# Altium schematic sheet TIA_SWITCHES.SchDoc
size A3; DrawnBy: Nicholas Sandor; Revision: V26C (V26.4a); SheetNumber: 5; SheetTotal: 7
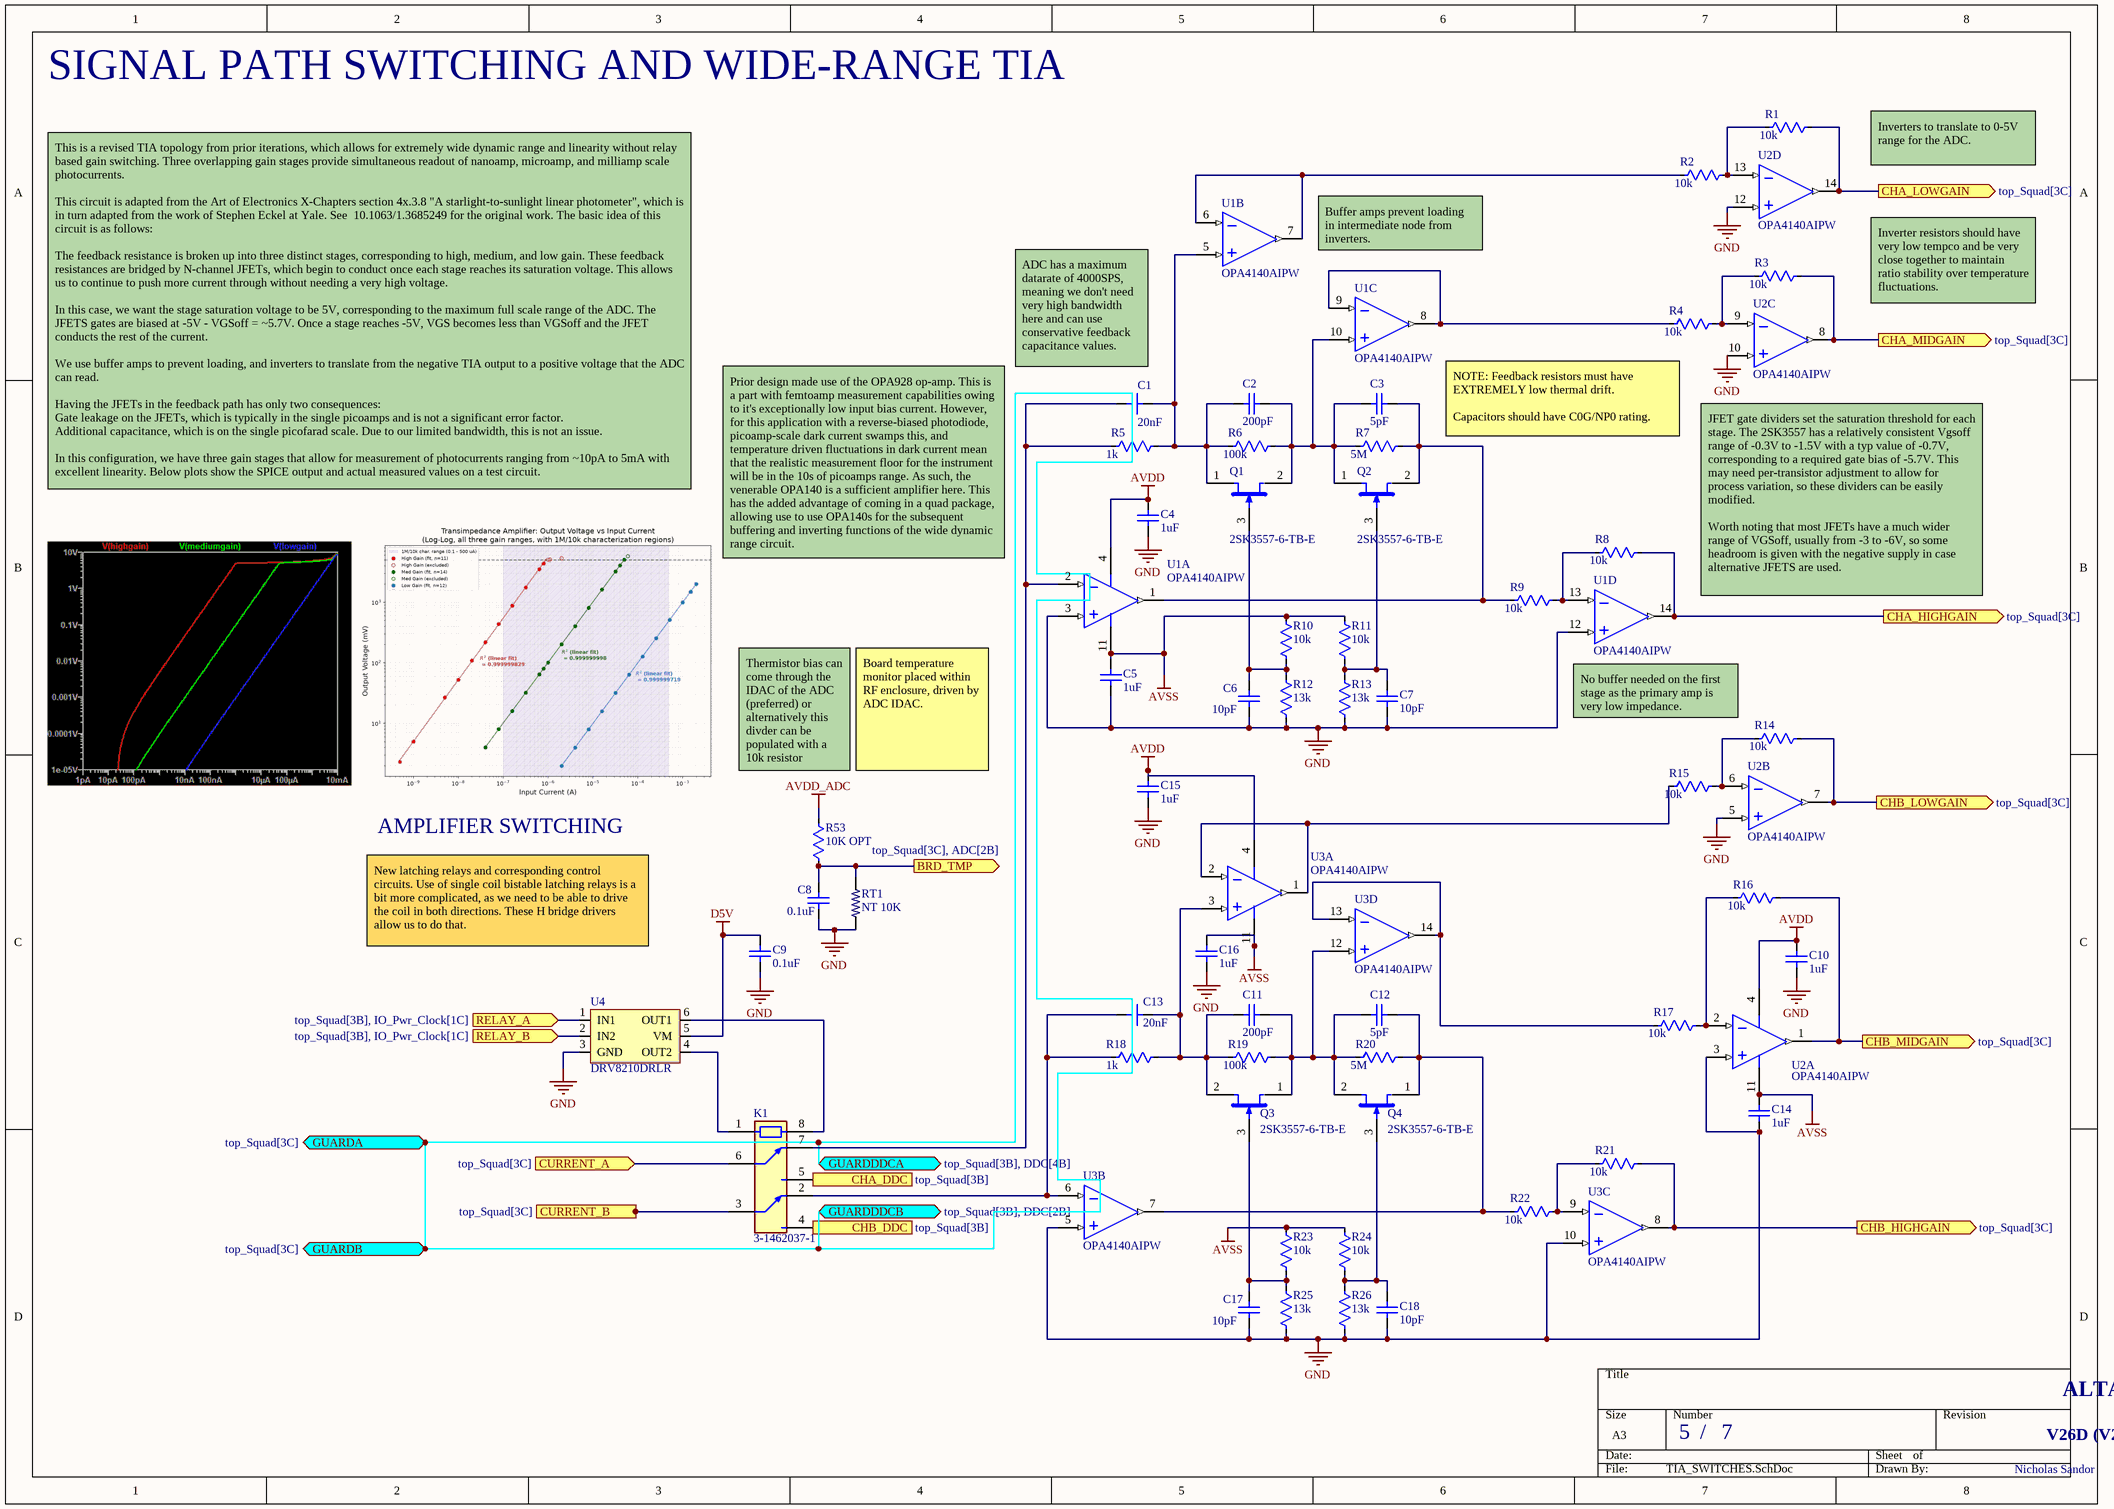
[diagram p0: TIA_SWITCHES.SchDoc]

## Parts
C1  20nF  [CAP 1206 UNKNOWN]
C2  200pF  [CAP 1206 UNKNOWN]
C3  5pF  [CAP 1206 UNKNOWN]
C4  1uF  [CAP 0603 IPC MID DENSITY]
C5  1uF  [CAP 0603 IPC MID DENSITY]
C6  10pF  [CAP 0603 IPC MID DENSITY MURATA]
C7  10pF  [CAP 0603 IPC MID DENSITY MURATA]
C8  0.1uF  [CAP 0603 IPC MID DENSITY]
C9  0.1uF  [CAP 0603 IPC MID DENSITY]
C10  1uF  [CAP 0603 IPC MID DENSITY]
C11  200pF  [CAP 1206 UNKNOWN]
C12  5pF  [CAP 1206 UNKNOWN]
C13  20nF  [CAP 1206 UNKNOWN]
C14  1uF  [CAP 0603 IPC MID DENSITY]
C15  1uF  [CAP 0603 IPC MID DENSITY]
C16  1uF  [CAP 0603 IPC MID DENSITY]
C17  10pF  [CAP 0603 IPC MID DENSITY MURATA]
C18  10pF  [CAP 0603 IPC MID DENSITY MURATA]
K1  3-1462037-1  [RELAY_3-1462037-1]
Q1  2SK3557-6-TB-E  [ONSC-CP-3-318AN_A_V]
Q2  2SK3557-6-TB-E  [ONSC-CP-3-318AN_A_V]
Q3  2SK3557-6-TB-E  [ONSC-CP-3-318AN_A_V]
Q4  2SK3557-6-TB-E  [ONSC-CP-3-318AN_A_V]
R1  10k  [RES 0603 IPC MID DENSITY]
R2  10k  [RES 0603 IPC MID DENSITY]
R3  10k  [RES 0603 IPC MID DENSITY]
R4  10k  [RES 0603 IPC MID DENSITY]
R5  1k  [RES 1206 IPC MID DENSITY]
R6  100k  [RES 1206 IPC MID DENSITY]
R7  5M  [RES 1206 IPC MID DENSITY]
R8  10k  [RES 0603 IPC MID DENSITY]
R9  10k  [RES 0603 IPC MID DENSITY]
R10  10k  [RES 0603 IPC MID DENSITY]
R11  10k  [RES 0603 IPC MID DENSITY]
R12  13k  [RES 0603 IPC MID DENSITY]
R13  13k  [RES 0603 IPC MID DENSITY]
R14  10k  [RES 0603 IPC MID DENSITY]
R15  10k  [RES 0603 IPC MID DENSITY]
R16  10k  [RES 0603 IPC MID DENSITY]
R17  10k  [RES 0603 IPC MID DENSITY]
R18  1k  [RES 1206 IPC MID DENSITY]
R19  100k  [RES 1206 IPC MID DENSITY]
R20  5M  [RES 1206 IPC MID DENSITY]
R21  10k  [RES 0603 IPC MID DENSITY]
R22  10k  [RES 0603 IPC MID DENSITY]
R23  10k  [RES 0603 IPC MID DENSITY]
R24  10k  [RES 0603 IPC MID DENSITY]
R25  13k  [RES 0603 IPC MID DENSITY]
R26  13k  [RES 0603 IPC MID DENSITY]
R53  10K OPT  [RES 0603 IPC MID DENSITY]
RT1  value NT 10K  [RES 0603 IPC MID DENSITY]  (hidden comment: NTC 0603 10K 1%)
U1  OPA4140AIPW  [PW0014A_N]  (parts A,B,C,D of 4)
U2  OPA4140AIPW  [PW0014A_N]  (parts A,B,C,D of 4)
U3  OPA4140AIPW  [PW0014A_N]  (parts A,B,C,D of 4)
U4  DRV8210DRLR  [SOT563]

## Ports
BRD_TMP (out, see top_Squad[3C], ADC[2B]), CHA_DDC (out, see top_Squad[3B]), CHA_HIGHGAIN (out, see top_Squad[3C]), CHA_LOWGAIN (out, see top_Squad[3C]), CHA_MIDGAIN (out, see top_Squad[3C]), CHB_DDC (out, see top_Squad[3B]), CHB_HIGHGAIN (out, see top_Squad[3C]), CHB_LOWGAIN (out, see top_Squad[3C]), CHB_MIDGAIN (out, see top_Squad[3C]), CURRENT_A (in, see top_Squad[3C]), CURRENT_B (in, see top_Squad[3C]), GUARDA (bidir, see top_Squad[3C]), GUARDB (bidir, see top_Squad[3C]), GUARDDDCA (bidir, see top_Squad[3B], DDC[4B]), GUARDDDCB (bidir, see top_Squad[3B], DDC[2B]), RELAY_A (in, see top_Squad[3B], IO_Pwr_Clock[1C]), RELAY_B (in, see top_Squad[3B], IO_Pwr_Clock[1C])

## Nets
AVDD: C4.2 C10.2 C15.2 U1.4(V+) U2.4(V+) U3.4(V+)
AVDD_ADC: R53.1
AVSS: C5.2 C14.2 C16.2 R10.2 R11.2 R23.2 R24.2 U1.11(V-) U2.11(V-) U3.11(V-)
D5V: C9.2 U4.5(VM)
GND: C4.1 C5.1 C6.1 C7.1 C8.1 C9.1 C10.1 C14.1 C15.1 C16.1 C17.1 C18.1 R12.1 R13.1 R25.1 R26.1 RT1.1 U1.3(IN_A+) U1.12(IN_D+) U2.3(IN_A+) U2.5(IN_B+) U2.10(IN_C+) U2.12(IN_D+) U3.5(IN_B+) U3.10(IN_C+) U4.3(GND)
BRD_TMP: C8.2 R53.2 RT1.2 ; port BRD_TMP
CHA_DDC: K1.5(NO1) ; port CHA_DDC
CHA_HIGHGAIN: R8.2 U1.14(OUT_D) ; port CHA_HIGHGAIN
CHA_LOWGAIN: R1.2 U2.14(OUT_D) ; port CHA_LOWGAIN
CHA_MIDGAIN: R3.2 U2.8(OUT_C) ; port CHA_MIDGAIN
CHB_DDC: K1.4(NO2) ; port CHB_DDC
CHB_HIGHGAIN: R21.2 U3.8(OUT_C) ; port CHB_HIGHGAIN
CHB_LOWGAIN: R14.2 U2.7(OUT_B) ; port CHB_LOWGAIN
CHB_MIDGAIN: R16.2 U2.1(OUT_A) ; port CHB_MIDGAIN
CURRENT_A: K1.6(COM1) ; port CURRENT_A
CURRENT_B: K1.3(COM2) ; port CURRENT_B
GUARDA: port GUARDB, port GUARDA, port GUARDDDCB, port GUARDDDCA
RELAY_A: U4.1(IN1) ; port RELAY_A
RELAY_B: U4.2(IN2) ; port RELAY_B
NetC1_1: C1.1 C2.2 Q1.1(S) R5.2 R6.1 U1.5(IN_B+)
NetC1_2: C1.2 K1.7(NC1) R5.1 U1.2(IN_A-)
NetC2_1: C2.1 C3.2 Q1.2(D) Q2.1(S) R6.2 R7.1 U1.10(IN_C+)
NetC3_1: C3.1 Q2.2(D) R7.2 R9.1 U1.1(OUT_A)
NetC6_2: C6.2 Q1.3(G) R10.1 R12.2
NetC7_2: C7.2 Q2.3(G) R11.1 R13.2
NetC11_1: C11.1 C12.2 Q3.1(S) Q4.2(D) R19.2 R20.1 U3.12(IN_D+)
NetC11_2: C11.2 C13.1 Q3.2(D) R18.2 R19.1 U3.3(IN_A+)
NetC12_1: C12.1 Q4.1(S) R20.2 R22.1 U3.7(OUT_B)
NetC13_2: C13.2 K1.2(NC2) R18.1 U3.6(IN_B-)
NetC17_2: C17.2 Q3.3(G) R23.1 R25.2
NetC18_2: C18.2 Q4.3(G) R24.1 R26.2
NetK1_1: K1.1(COIL1) U4.4(OUT2)
NetK1_8: K1.8(COIL2) U4.6(OUT1)
NetR1_1: R1.1 R2.2 U2.13(IN_D-)
NetR2_1: R2.1 U1.6(IN_B-) U1.7(OUT_B)
NetR3_1: R3.1 R4.2 U2.9(IN_C-)
NetR4_1: R4.1 U1.8(OUT_C) U1.9(IN_C-)
NetR8_1: R8.1 R9.2 U1.13(IN_D-)
NetR14_1: R14.1 R15.2 U2.6(IN_B-)
NetR15_1: R15.1 U3.1(OUT_A) U3.2(IN_A-)
NetR16_1: R16.1 R17.2 U2.2(IN_A-)
NetR17_1: R17.1 U3.13(IN_D-) U3.14(OUT_D)
NetR21_1: R21.1 R22.2 U3.9(IN_C-)

## Notes on the sheet
- SIGNAL PATH SWITCHING AND WIDE-RANGE TIA
- Inverters to translate to 0-5V range for the ADC.
- (near U1) Buffer amps prevent loading in intermediate node from inverters.
- Inverter resistors should have very low tempco and be very close together to maintain ratio stability over temperature fluctuations.
- (near C1) ADC has a maximum datarate of 4000SPS, meaning we don't need very high bandwidth here and can use conservative feedback capacitance values.
- NOTE: Feedback resistors must have EXTREMELY low thermal drift.
  Capacitors should have C0G/NP0 rating.
- This is a revised TIA topology from prior iterations, which allows for extremely wide dynamic range and linearity without relay based gain switching. Three overlapping gain stages provide simultaneous readout of nanoamp, microamp, and milliamp scale photocurrents.
  This circuit is adapted from the Art of Electronics X-Chapters section 4x.3.8 "A starlight-to-sunlight linear photometer", which is in turn adapted from the work of Stephen Eckel at Yale. See  10.1063/1.3685249 for the original work. The basic idea of this circuit is as follows:
  The feedback resistance is broken up into three distinct stages, corresponding to high, medium, and low gain. These feedback resistances are bridged by N-channel JFETs, which begin to conduct once each stage reaches its saturation voltage. This allows us to continue to push more current through without needing a very high voltage.
  In this case, we want the stage saturation voltage to be 5V, corresponding to the maximum full scale range of the ADC. The JFETS gates are biased at -5V - VGSoff = ~5.7V. Once a stage reaches -5V, VGS becomes less than VGSoff and the JFET conducts the rest of the current.
  We use buffer amps to prevent loading, and inverters to translate from the negative TIA output to a positive voltage that the ADC can read.
  Having the JFETs in the feedback path has only two consequences:
  Gate leakage on the JFETs, which is typically in the single picoamps and is not a significant error factor.
  Additional capacitance, which is on the single picofarad scale. Due to our limited bandwidth, this is not an issue.
  In this configuration, we have three gain stages that allow for measurement of photocurrents ranging from ~10pA to 5mA with excellent linearity. Below plots show the SPICE output and actual measured values on a test circuit.
- Prior design made use of the OPA928 op-amp. This is a part with femtoamp measurement capabilities owing to it's exceptionally low input bias current. However, for this application with a reverse-biased photodiode, picoamp-scale dark current swamps this, and temperature driven fluctuations in dark current mean that the realistic measurement floor for the instrument will be in the 10s of picoamps range. As such, the venerable OPA140 is a sufficient amplifier here. This has the added advantage of coming in a quad package, allowing use to use OPA140s for the subsequent buffering and inverting functions of the wide dynamic range circuit.
- JFET gate dividers set the saturation threshold for each stage. The 2SK3557 has a relatively consistent Vgsoff range of -0.3V to -1.5V with a typ value of -0.7V, corresponding to a required gate bias of -5.7V. This may need per-transistor adjustment to allow for process variation, so these dividers can be easily modified.
  Worth noting that most JFETs have a much wider range of VGSoff, usually from -3 to -6V, so some headroom is given with the negative supply in case alternative JFETS are used.
- No buffer needed on the first stage as the primary amp is very low impedance.
- (near R53) Thermistor bias can come through the IDAC of the ADC (preferred) or alternatively this divder can be populated with a 10k resistor
- Board temperature monitor placed within RF enclosure, driven by ADC IDAC.
- AMPLIFIER SWITCHING
- New latching relays and corresponding control circuits. Use of single coil bistable latching relays is a bit more complicated, as we need to be able to drive the coil in both directions. These H bridge drivers allow us to do that.
- /
- V26D (V26.5a)
- ALTAIR PhotoDiode ReadOut (PDRO) - Squad

## Library data of the parts
C1-C3 C6 C7 C11-C13 C17 C18 = CAP: Wurth Elektronik 885012008037 - Cap Ceramic 10pF 5% 50V NP0 1206; MF: Wurth Elektronik; MP: 885012008037
C4 C5 C10 C14-C16 = CAP: Murata GRT188R61H105KE13D - Cap MLCC AEC-Q200 X5R 1uF 50V 0603; MF: Murata; MP: GRT188R61H105KE13D
C8 C9 = CAP: Kemet C0603C104K5RACAUTO - Cap Ceramic 0.1uF 50V X7R 10% 0603 125C Paper T/R; MF: Kemet; MP: C0603C104K5RACAUTO
K1 = 3-1462037-1: RelÃ© RF, CC, biestable, 1 bobina, 2 conectores DPDT-CO de forma C, capacidad de contacto de 2 A, voltaje de bobina de 4,5 V CC, voltaje de contacto de 250 V CA, Axicom IM; MF: TE Connectivity; SnapEDA_Link: https://www.snapeda.com/parts/3-1462037-1/TE+Connectivity+Potter+%2526+Brumfield+Relays/view-part/?ref=snap; Package: None; Value: *; MP: 3-1462037-1; EU_RoHS_Compliance: Compliant; Check_prices: https://www.snapeda.com/parts/3-1462037-1/TE+Connectivity+Potter+%2526+Brumfield+Relays/view-part/?ref=eda
Q1-Q4 = CMP-1062-00010-1: N-Channel JFET, 15 V, 10 to 20 mA, 35 mS, 3-Pin CP, Pb-Free, Tape and Reel; Manufacturer: On Semiconductor; Channel Polarity: N Channel; IDSS Max (uA): 20000; IDSS Min (uA): 10000; PackageDescription: 3-Pin Small Outline Transistor, Body 2.9 x 1.5 mm, Pitch 0.95 mm; RoHS: Pb-Free; PackageReference: CP-3-318AN_A; ComponentLink2Description: Datasheet; Packing: Tape and Reel; ComponentLink2URL: http://www.onsemi.com/pub_link/Collateral/2SK3557-D.PDF; ComponentLink1URL: http://www.onsemi.com/; PartNumber: 2SK3557-6-TB-E; ComponentLink3URL: http://www.onsemi.com/pub_link/Collateral/EN6619-D.PDF; ComponentLink3Description: Package Specification; Mounting Technology: Surface Mount; ComponentLink1Description: Manufacturer URL
R1-R26 = RES: Vishay TNPV12061M00BYEN - Res 1MOhm 0.1% 1/4W SMD 1206; MF: Vishay Dale; MP: TNPV12061M00BYEN
R53 = RES: Yageo RC0402JR-070RL - Res 0 Ohms 1/16W SMD 0402; MF: YAGEO; MP: RC0402JR-070RL
RT1 = THERM_RES NTC 0603 10K 1%: THERMISTOR NTC 10KOHM 3380K 0603; MF: Murata; MP: NCU18XH103F60RB; RoHS: No; Category: Thermistors; Stock 1: 48580; Case/Package: 0603; Case Code (Metric): 1608; Case Code (Imperial): 0603; Min Operating Temperature: -40°C; Max Operating Temperature: 125°C; REACH SVHC: No SVHC; ComponentLink1URL: http://www.farnell.com/datasheets/2095755.pdf?src-supplier=Farnell; ComponentLink1Description: http://www.farnell.com/datasheets/2095755.pdf?src-supplier=Farnell; ComponentLink2URL: https://www.murata.com/en-us/products/productdata/8796836233246/L0770E.pdf?src-supplier=Digi-Key; ComponentLink2Description: https://www.murata.com/en-us/products/productdata/8796836233246/L0770E.pdf?src-supplier=Digi-Key; ComponentLink3URL: http://www.farnell.com/datasheets/2095755.pdf?src-supplier=Element14; ComponentLink3Description: http://www.farnell.com/datasheets/2095755.pdf?src-supplier=Element14; Supplier 1: Digi-Key; Supplier Part Number 1: 490-16279-1-ND
U1-U3 = CMP-0272-01663-3: 11 MHz, Single Supply, Low Noise, Precision, Rail-to-Rail Output, JFET Amplifier, 4.5 to 36 V, -40 to 125 degC, 14-pin SOP (PW14), Green (RoHS & no Sb/Br); Manufacturer: Texas Instruments; Number of Channels: 4; Sub Family: High Supply Voltage Amplifier (>=30V), Low Input Bias Current Amp (<=10pA), Low Noise Amp (<=10nV/rtHz), Low Offset Voltage Amplifier (<=500uV), Precision Amplifier; CMRR(Min)(dB): 126; Packing: BULK; Offset Drift(Typ)(uV/C): 0.35; Iq per channel(Max)(mA): 2; Rating: Catalog; Total Supply Voltage(Min)(+5V is 5, +/-5V is 10): 4.5; Total Supply Voltage(Max)(+5V is 5, +/-5V is 10): 36; IIB(Max)(pA): 10; Vio (25C)(Max)(mV): 0.12; GBW(Typ)(MHz): 11; Slew Rate(Typ)(V/us): 20; Code_JEDEC: MO-153; ComponentLink3URL: http://www.ti.com/litv/pdf/mpds360; ComponentLink1URL: http://www.ti.com/; Mounting Technology: Surface Mount; Eco-Plan: Green (RoHS & no Sb/Br); PackageReference: PW0014A; ComponentLink1Description: Manufacturer URL; ComponentLink2Description: Datasheet; PackageVersion: 4040064-3/G, 02/2011; PackageDescription: 14-Pin Plastic Small Outline, Body 5 x 4.4 mm, Pitch 0.65 mm; ComponentLink3Description: Package Specification; DatasheetVersion: SBOS498A; ComponentLink2URL: http://www.ti.com/lit/ds/symlink/opa4140.pdf; PartNumber: OPA4140AIPW
U4 = DRV8210DRLR: Bipolar Motor Driver NMOS PWM SOT-563